# EasyEDA schematic schematics.json
TITLE: Sheet_1; REV: 1.0; Date: 2024-05-15; Sheet: 1/1; Drawn By: Dhruv
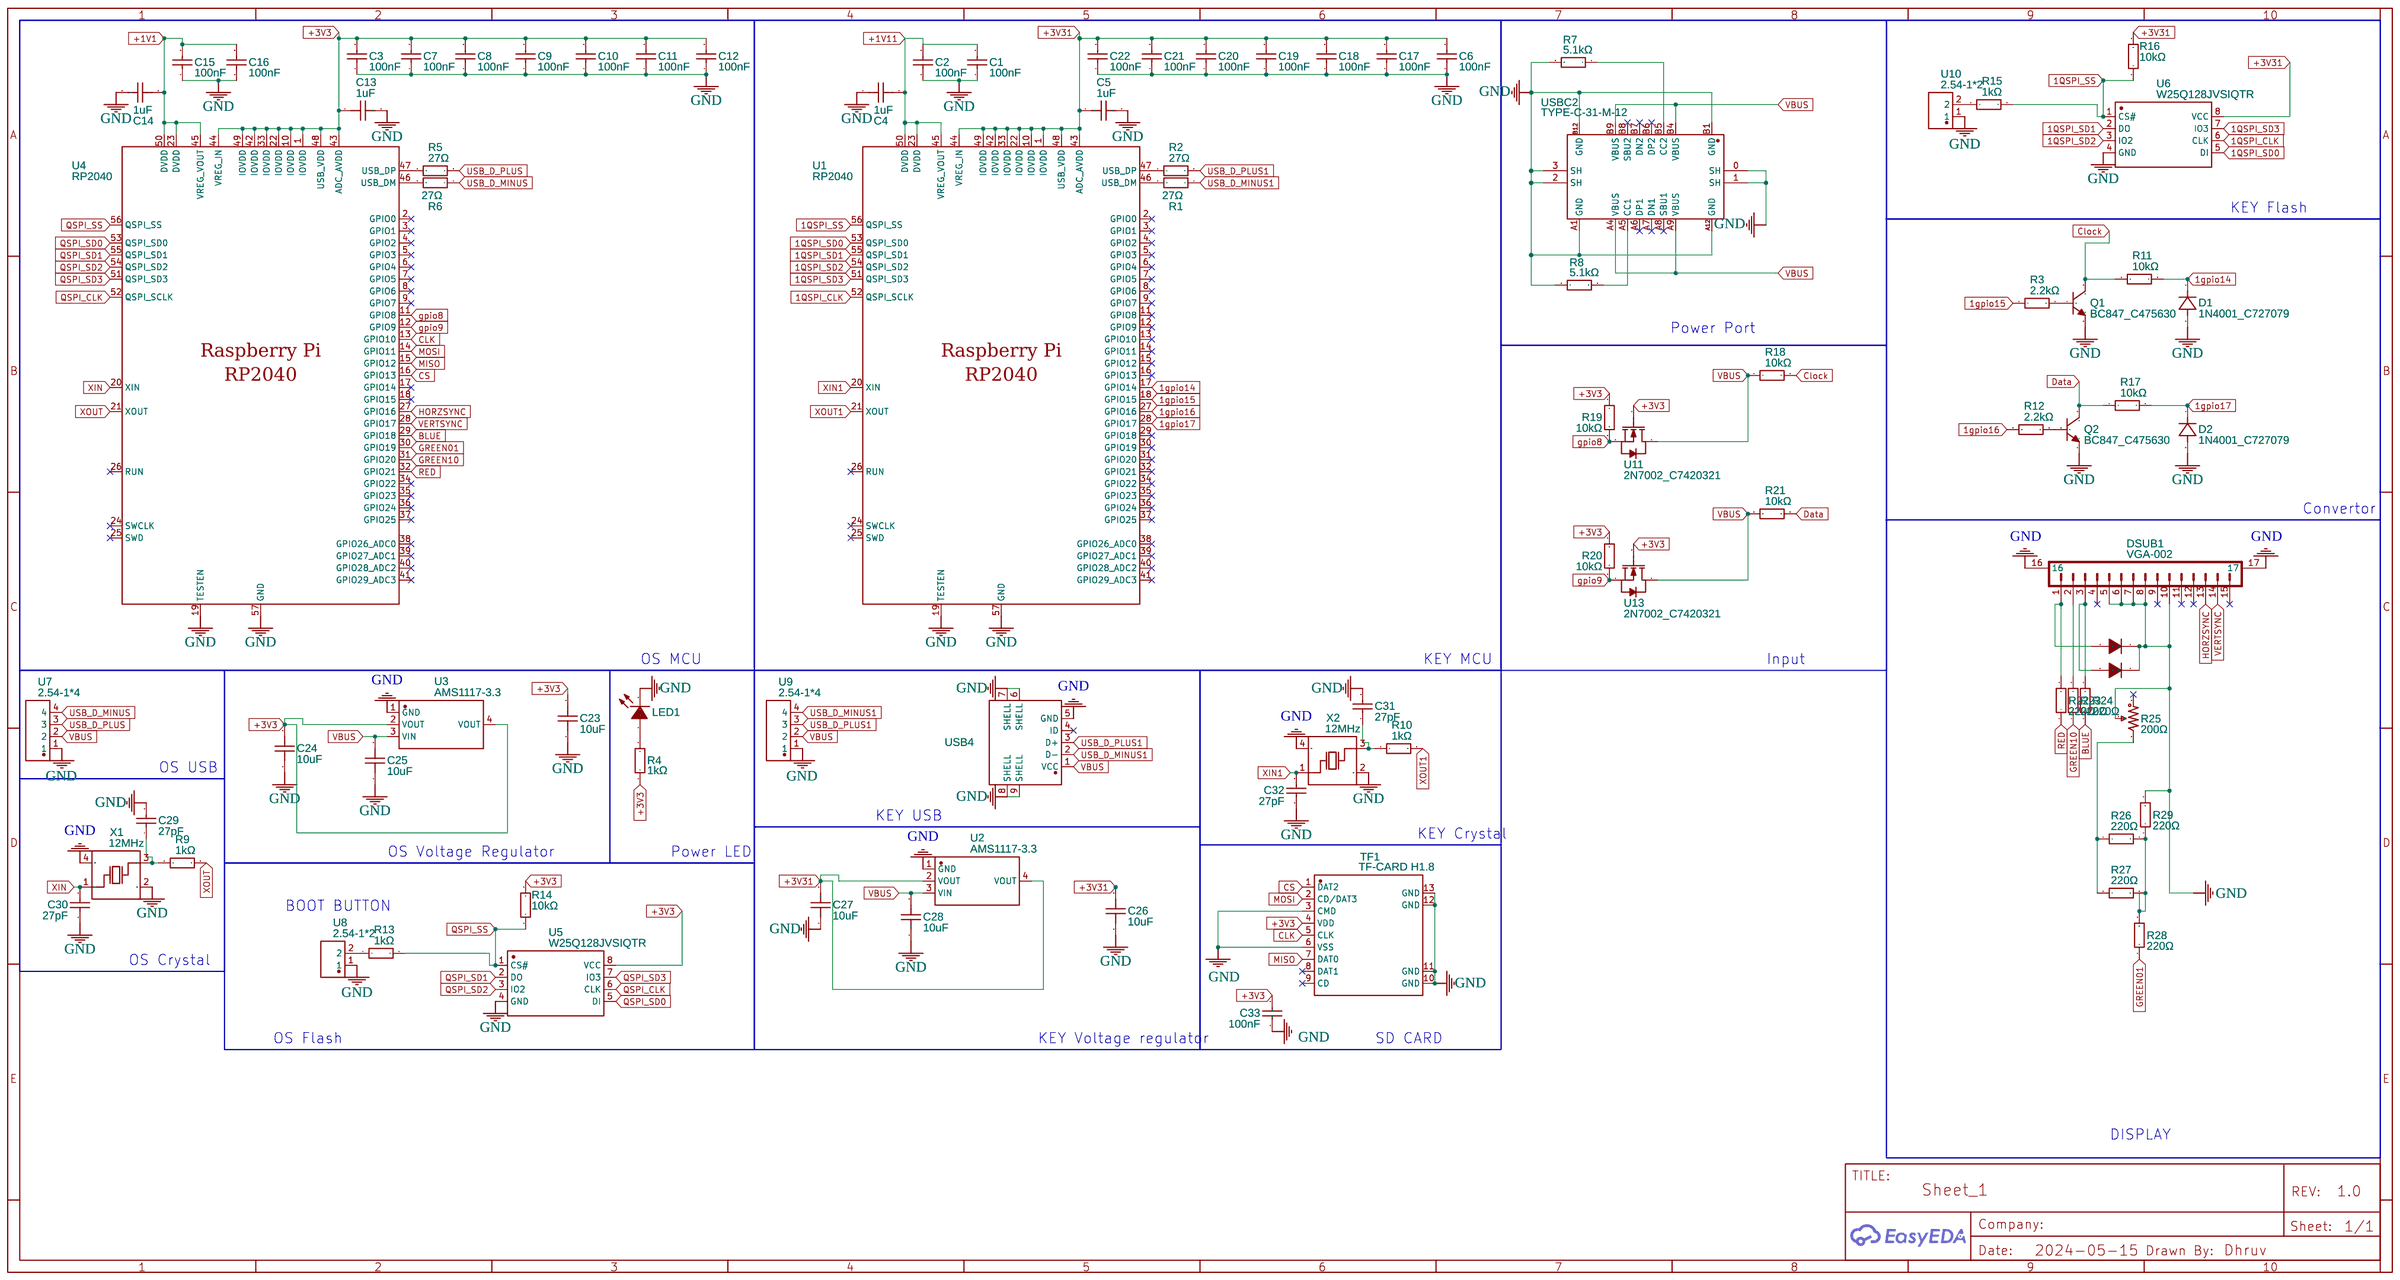
[diagram p0: schematic sheet]

## Parts
C1  100nF  [C0402]
C2  100nF  [C0402]
C3  100nF  [C0402]
C4  1uF  [C0402]
C5  1uF  [C0402]
C6  100nF  [C0402]
C7  100nF  [C0402]
C8  100nF  [C0402]
C9  100nF  [C0402]
C10  100nF  [C0402]
C11  100nF  [C0402]
C12  100nF  [C0402]
C13  1uF  [C0402]
C14  1uF  [C0402]
C15  100nF  [C0402]
C16  100nF  [C0402]
C17  100nF  [C0402]
C18  100nF  [C0402]
C19  100nF  [C0402]
C20  100nF  [C0402]
C21  100nF  [C0402]
C22  100nF  [C0402]
C23  10uF  [C0603]
C24  10uF  [C0603]
C25  10uF  [C0603]
C26  10uF  [C0603]
C27  10uF  [C0603]
C28  10uF  [C0603]
C29  27pF  [C0603]
C30  27pF  [C0603]
C31  27pF  [C0603]
C32  27pF  [C0603]
C33  100nF  [C0402]
D1  1N4001_C727079  [SMA_L4.3-W2.5-LS5.0-RD]
D2  1N4001_C727079  [SMA_L4.3-W2.5-LS5.0-RD]
D3  1N4148WS T4  [SOD-323_L1.8-W1.3-LS2.5-RD]
D4  1N4148WS T4  [SOD-323_L1.8-W1.3-LS2.5-RD]
DSUB1  VGA-002  [D-SUB-TH_VGA-002]
LED1  0603White light_C2290  [LED0603-R-RD_WHITE]
Q1  BC847_C475630  [SOT-23-3_L2.9-W1.3-P1.90-LS2.4-BR]
Q2  BC847_C475630  [SOT-23-3_L2.9-W1.3-P1.90-LS2.4-BR]
R1  27Ω  [R0805]
R2  27Ω  [R0805]
R3  2.2kΩ  [R0402]
R4  1kΩ  [R0402]
R5  27Ω  [R0805]
R6  27Ω  [R0805]
R7  5.1kΩ  [R0402]
R8  5.1kΩ  [R0402]
R9  1kΩ  [R0402]
R10  1kΩ  [R0402]
R11  10kΩ  [R0402]
R12  2.2kΩ  [R0402]
R13  1kΩ  [R0402]
R14  10kΩ  [R0402]
R15  1kΩ  [R0402]
R16  10kΩ  [R0402]
R17  10kΩ  [R0402]
R18  10kΩ  [R0402]
R19  10kΩ  [R0402]
R20  10kΩ  [R0402]
R21  10kΩ  [R0402]
R22  220Ω  [R0402]
R23  220Ω  [R0402]
R24  220Ω  [R0402]
R25  200Ω  [RES-ADJ-TH_3P-L6.8-W4.6-P2.50-TL-BS-3266W]
R26  220Ω  [R0402]
R27  220Ω  [R0402]
R28  220Ω  [R0402]
R29  220Ω  [R0402]
TF1  TF-CARD H1.8  [TF-SMD_TF-CARD-H1.8]
U1  RP2040  [LQFN-56_L7.0-W7.0-P0.4-EP]
U2  AMS1117-3.3  [SOT-223-3_L6.5-W3.4-P2.30-LS7.0-BR]
U3  AMS1117-3.3  [SOT-223-3_L6.5-W3.4-P2.30-LS7.0-BR]
U4  RP2040  [LQFN-56_L7.0-W7.0-P0.4-EP]
U5  W25Q128JVSIQTR  [SOIC-8_L5.3-W5.3-P1.27-LS8.0-BL]
U6  W25Q128JVSIQTR  [SOIC-8_L5.3-W5.3-P1.27-LS8.0-BL]
U7  2.54-1*4  [HDR-TH_4P-P2.54-V-M-1]
U8  2.54-1*2  [HDR-TH_2P-P2.54-V-M]
U9  2.54-1*4  [HDR-TH_4P-P2.54-V-M-1]
U10  2.54-1*2  [HDR-TH_2P-P2.54-V-M]
U11  2N7002_C7420321  [SOT-23-3_L2.9-W1.3-P1.90-LS2.4-BR]
U13  2N7002_C7420321  [SOT-23-3_L2.9-W1.3-P1.90-LS2.4-BR]
USB4  U224-051N-3GRA035  [USB-A-TH_U224-051N-3GRA035]
USBC2  TYPE-C-31-M-12  [USB-C_SMD-TYPE-C-31-M-12]
X1  12MHz  [OSC-SMD_4P-L3.2-W2.5-BL]
X2  12MHz  [OSC-SMD_4P-L3.2-W2.5-BL]

## Library data of the parts
C1-C3 C6-C12 C15-C22 C33 = CL05B104KO5NNNC: Supplier: LCSC; Manufacturer: SAMSUNG(三星); Supplier Part: C1525; JLCPCB Part Class: Basic Part
C4 C5 C13 C14 = CL05A105KA5NQNC: Supplier: LCSC; Manufacturer: SAMSUNG(三星); Supplier Part: C52923; JLCPCB Part Class: Basic Part
C23-C28 = CL10A106KP8NNNC: Supplier: LCSC; Manufacturer: SAMSUNG(三星); Supplier Part: C19702; JLCPCB Part Class: Basic Part
C29-C32 = CC0603JRNPO9BN270: Supplier: LCSC; Manufacturer: YAGEO(国巨); Supplier Part: C107045; JLCPCB Part Class: Extended Part
D1 D2 = 1N4001_C727079: Contributor: LCSC; Supplier: LCSC; Supplier Part: C727079; Manufacturer: TWGMC(台湾迪嘉); Manufacturer Part: 1N4001; JLCPCB Part Class: Extended Part
D3 D4 = 1N4148WS T4: Supplier: LCSC; Manufacturer: CJ(江苏长电/长晶); Manufacturer Part: 1N4148WS; Supplier Part: C2128; JLCPCB Part Class: Basic Part
DSUB1 = VGA-002: Supplier: LCSC; Manufacturer: BOOMELE(博穆精密); Supplier Part: C138387; JLCPCB Part Class: Extended Part
LED1 = 0603White light_C2290: Supplier: LCSC; Manufacturer: KENTO; Manufacturer Part: KT-0603白灯; Supplier Part: C2290; JLCPCB Part Class: Basic Part
Q1 Q2 = BC847_C475630: Contributor: LCSC; Supplier: LCSC; Supplier Part: C475630; Manufacturer: SHIKUES(时科); Manufacturer Part: BC847; JLCPCB Part Class: Extended Part
R1 R2 R5 R6 = 0805W8F270JT5E: Supplier: LCSC; Manufacturer: UNI-ROYAL(厚声); Supplier Part: C17594; JLCPCB Part Class: Extended Part
R3 R12 = 0402WGF2201TCE: Supplier: LCSC; Manufacturer: UNI-ROYAL(厚声); Supplier Part: C25879; JLCPCB Part Class: Basic Part
R4 R9 R10 R13 R15 = 0402WGF1001TCE: Supplier: LCSC; Manufacturer: UNI-ROYAL(厚声); Supplier Part: C11702; JLCPCB Part Class: Basic Part
R7 R8 = RTT02512JTH: Supplier: LCSC; Manufacturer: RALEC(旺诠); Supplier Part: C103086; Resistance (Ohms): 5.1K; JLCPCB Part Class: Extended Part
R11 R14 R16-R21 = 0402WGF1002TCE: Supplier: LCSC; Manufacturer: UNI-ROYAL(厚声); Supplier Part: C25744; JLCPCB Part Class: Basic Part
R22-R24 R26-R29 = 0402WGF2200TCE: Supplier: LCSC; Manufacturer: UNI-ROYAL(厚声); Supplier Part: C25091; JLCPCB Part Class: Basic Part
R25 = 3266W-1-201: Resistance(Ohms): 200; Contributor: LCSC; Supplier: LCSC; Supplier Part: C124981; Manufacturer: BOCHEN(博晨); JLCPCB Part Class: Extended Part
TF1 = TF-CARD H1.8: Supplier: LCSC; Supplier Part: C7529389; Manufacturer: SHOU HAN(首韩); Contributor: lcsc; JLCPCB Part Class: Extended Part
U1 U4 = RP2040: Contributor: LCSC; Supplier: LCSC; Supplier Part: C2040; Manufacturer: Raspberry Pi(树莓派); JLCPCB Part Class: Extended Part
U2 U3 = AMS1117-3.3: sourceId: dwIGgezVh; Supplier: LCSC; Manufacturer: AMS; Supplier Part: C6186; JLCPCB Part Class: Basic Part
U5 U6 = W25Q128JVSIQTR: Supplier: LCSC; Manufacturer: WINBOND(华邦); Manufacturer Part: W25Q128JVSIQ; Supplier Part: C97521; JLCPCB Part Class: Basic Part
U7 U9 = 2.54-1*4: Supplier: LCSC; Supplier Part: C5116483; Manufacturer: ZHOURI(洲日); JLCPCB Part Class: Extended Part; Contributor: lcsc
U8 U10 = 2.54-1*2: Contributor: lcsc; Supplier: LCSC; Supplier Part: C5116481; Manufacturer: ZHOURI(洲日); JLCPCB Part Class: Extended Part
U11 U13 = 2N7002_C7420321: Contributor: lcsc; Supplier: LCSC; Supplier Part: C7420321; Manufacturer: 宏迦橙; Manufacturer Part: 2N7002; JLCPCB Part Class: Extended Part
USB4 = U224-051N-3GRA035: Supplier: LCSC; Supplier Part: C2689740; Manufacturer: XKB Connectivity(中国星坤); Contributor: lcsc; JLCPCB Part Class: Extended Part
USBC2 = TYPE-C-31-M-12: Supplier: LCSC; Supplier Part: C165948; Manufacturer: 韩国韩荣; Contributor: LCSC; JLCPCB Part Class: Extended Part
X1 X2 = X322512MSB4SI: Supplier: LCSC; Manufacturer: YXC(扬兴晶振); Supplier Part: C9002; JLCPCB Part Class: Basic Part

## Nets
+1V1: C14.2 C15.2 C16.2 U4.23(DVDD) U4.45(VREG_VOUT) U4.50(DVDD)
+1V11: C1.2 C2.2 C4.2 U1.23(DVDD) U1.45(VREG_VOUT) U1.50(DVDD)
+3V3: C3.2 C7.2 C8.2 C9.2 C10.2 C11.2 C12.2 C13.1 C23.2 C24.2 C33.1 R4.1 R14.2 R19.1 R20.1 TF1.4(VDD) U3.2(VOUT) U3.4(VOUT) U4.1(IOVDD) U4.10(IOVDD) U4.22(IOVDD) U4.33(IOVDD) U4.42(IOVDD) U4.43(ADC_AVDD) U4.44(VREG_IN) U4.48(USB_VDD) U4.49(IOVDD) U5.8(VCC) U11.1(G) U13.1(G)
+3V31: C5.1 C6.2 C17.2 C18.2 C19.2 C20.2 C21.2 C22.2 C26.2 C27.2 R16.2 U1.1(IOVDD) U1.10(IOVDD) U1.22(IOVDD) U1.33(IOVDD) U1.42(IOVDD) U1.43(ADC_AVDD) U1.44(VREG_IN) U1.48(USB_VDD) U1.49(IOVDD) U2.2(VOUT) U2.4(VOUT) U6.8(VCC)
GND: C1.1 C2.1 C3.1 C4.1 C5.2 C6.1 C7.1 C8.1 C9.1 C10.1 C11.1 C12.1 C13.2 C14.1 C15.1 C16.1 C17.1 C18.1 C19.1 C20.1 C21.1 C22.1 C23.1 C24.1 C25.1 C26.1 C27.1 C28.1 C29.2 C30.1 C31.2 C32.1 C33.2 D1.2(A) D2.2(A) D3.1(K) D4.1(K) DSUB1.5 DSUB1.6 DSUB1.7 DSUB1.8 DSUB1.10 DSUB1.16 DSUB1.17 LED1.2(K) Q1.2(E) Q2.2(E) R7.2 R8.1 R25.2 R29.2 TF1.3(CMD) TF1.6(VSS) TF1.10(GND) TF1.11(GND) TF1.12(GND) TF1.13(GND) U1.19(TESTEN) U1.57(GND) U2.1(GND) U3.1(GND) U4.19(TESTEN) U4.57(GND) U5.4(GND) U6.4(GND) U7.1 U8.1 U9.1 U10.1 USB4.5(GND) USB4.6(SHELL) USB4.7(SHELL) USB4.8(SHELL) USB4.9(SHELL) USBC2.0(SH) USBC2.1(SH) USBC2.2(SH) USBC2.3(SH) USBC2.A1(GND) USBC2.A12(GND) USBC2.B1(GND) USBC2.B12(GND) X1.2(GND) X1.4(GND) X2.2(GND) X2.4(GND)
VBUS: C25.2 C28.2 R18.1 R21.1 U2.3(VIN) U3.3(VIN) U7.2 U9.2 U11.3(D) U13.3(D) USB4.1(VCC) USBC2.A4(VBUS) USBC2.A9(VBUS) USBC2.B4(VBUS) USBC2.B9(VBUS)
1gpio14: D1.1(K) R11.2 U1.17(GPIO14)
1gpio15: R3.1 U1.18(GPIO15)
1gpio16: R12.1 U1.27(GPIO16)
1gpio17: D2.1(K) R17.2 U1.28(GPIO17)
1QSPI_CLK: U1.52(QSPI_SCLK) U6.6(CLK)
1QSPI_SD0: U1.53(QSPI_SD0) U6.5(DI)
1QSPI_SD1: U1.55(QSPI_SD1) U6.2(DO)
1QSPI_SD2: U1.54(QSPI_SD2) U6.3(IO2)
1QSPI_SD3: U1.51(QSPI_SD3) U6.7(IO3)
1QSPI_SS: R15.2 R16.1 U1.56(QSPI_SS) U6.1(CS#)
BLUE: R24.1 U4.29(GPIO18)
CLK: TF1.5(CLK) U4.13(GPIO10)
Clock: Q1.3(C) R11.1 R18.2
CS: TF1.1(DAT2) U4.16(GPIO13)
Data: Q2.3(C) R17.1 R21.2
gpio8: R19.2 U4.11(GPIO8) U11.2(S)
gpio9: R20.2 U4.12(GPIO9) U13.2(S)
GREEN01: R28.1 U4.30(GPIO19)
GREEN10: R23.1 U4.31(GPIO20)
HORZSYNC: DSUB1.13 U4.27(GPIO16)
MISO: TF1.7(DAT0) U4.15(GPIO12)
MOSI: TF1.2(CD/DAT3) U4.14(GPIO11)
QSPI_CLK: U4.52(QSPI_SCLK) U5.6(CLK)
QSPI_SD0: U4.53(QSPI_SD0) U5.5(DI)
QSPI_SD1: U4.55(QSPI_SD1) U5.2(DO)
QSPI_SD2: U4.54(QSPI_SD2) U5.3(IO2)
QSPI_SD3: U4.51(QSPI_SD3) U5.7(IO3)
QSPI_SS: R13.2 R14.1 U4.56(QSPI_SS) U5.1(CS#)
RED: R22.1 U4.32(GPIO21)
USB_D_MINUS: R6.1 U7.4
USB_D_MINUS1: R1.1 U9.4 USB4.2(D-)
USB_D_PLUS: R5.2 U7.3
USB_D_PLUS1: R2.2 U9.3 USB4.3(D+)
VERTSYNC: DSUB1.14 U4.28(GPIO17)
XIN: C30.2 U4.20(XIN) X1.1(OSC1)
XIN1: C32.2 U1.20(XIN) X2.1(OSC1)
XOUT: R9.2 U4.21(XOUT)
XOUT1: R10.2 U1.21(XOUT)
Net-(C29-1): C29.1 R9.1 X1.3(OSC2)
Net-(C31-1): C31.1 R10.1 X2.3(OSC2)
Net-(D3-2): D3.2(A) DSUB1.3 R24.2
Net-(D4-2): D4.2(A) DSUB1.1 R22.2
Net-(DSUB1-2): DSUB1.2 R23.2
Net-(LED1-1): LED1.1(A) R4.2
Net-(Q1-1): Q1.1(B) R3.2
Net-(Q2-1): Q2.1(B) R12.2
Net-(R1-2): R1.2 U1.46(USB_DM)
Net-(R2-1): R2.1 U1.47(USB_DP)
Net-(R5-1): R5.1 U4.47(USB_DP)
Net-(R6-2): R6.2 U4.46(USB_DM)
Net-(R7-1): R7.1 USBC2.B5(CC2)
Net-(R8-2): R8.2 USBC2.A5(CC1)
Net-(R13-1): R13.1 U8.2
Net-(R15-1): R15.1 U10.2
Net-(R25-3): R25.3 R26.1 R27.1
Net-(R26-2): R26.2 R27.2 R28.2 R29.1

Not connected (* = marked no-connect by the designer): DSUB1 4* 9* 11* 12* 15*; R25 1*; TF1 8(DAT1)* 9(CD)*; U1 2(GPIO0)* 3(GPIO1)* 4(GPIO2)* 5(GPIO3)* 6(GPIO4)* 7(GPIO5)* 8(GPIO6)* 9(GPIO7)* 11(GPIO8)* 12(GPIO9)* 13(GPIO10)* 14(GPIO11)* 15(GPIO12)* 16(GPIO13)* 24(SWCLK)* 25(SWD)* 26(RUN)* 29(GPIO18)* 30(GPIO19)* 31(GPIO20)* 32(GPIO21)* 34(GPIO22)* 35(GPIO23)* 36(GPIO24)* 37(GPIO25)* 38(GPIO26_ADC0)* 39(GPIO27_ADC1)* 40(GPIO28_ADC2)* 41(GPIO29_ADC3)*; U4 2(GPIO0)* 3(GPIO1)* 4(GPIO2)* 5(GPIO3)* 6(GPIO4)* 7(GPIO5)* 8(GPIO6)* 9(GPIO7)* 17(GPIO14)* 18(GPIO15)* 24(SWCLK)* 25(SWD)* 26(RUN)* 34(GPIO22)* 35(GPIO23)* 36(GPIO24)* 37(GPIO25)* 38(GPIO26_ADC0)* 39(GPIO27_ADC1)* 40(GPIO28_ADC2)* 41(GPIO29_ADC3)*; USB4 4(ID)*; USBC2 A6(DP1)* A7(DN1)* A8(SBU1)* B6(DP2)* B7(DN2)* B8(SBU2)*

## Notes on the sheet
- KEY Flash
- Power Port
- Convertor
- OS MCU
- KEY MCU
- Input
- OS USB
- KEY USB
- KEY Crystal
- OS Voltage Regulator
- Power LED
- BOOT BUTTON
- OS Crystal
- OS Flash
- KEY Voltage regulator
- SD CARD
- DISPLAY
